# Altium schematic sheet H3_DDR3.SchDoc
size A3
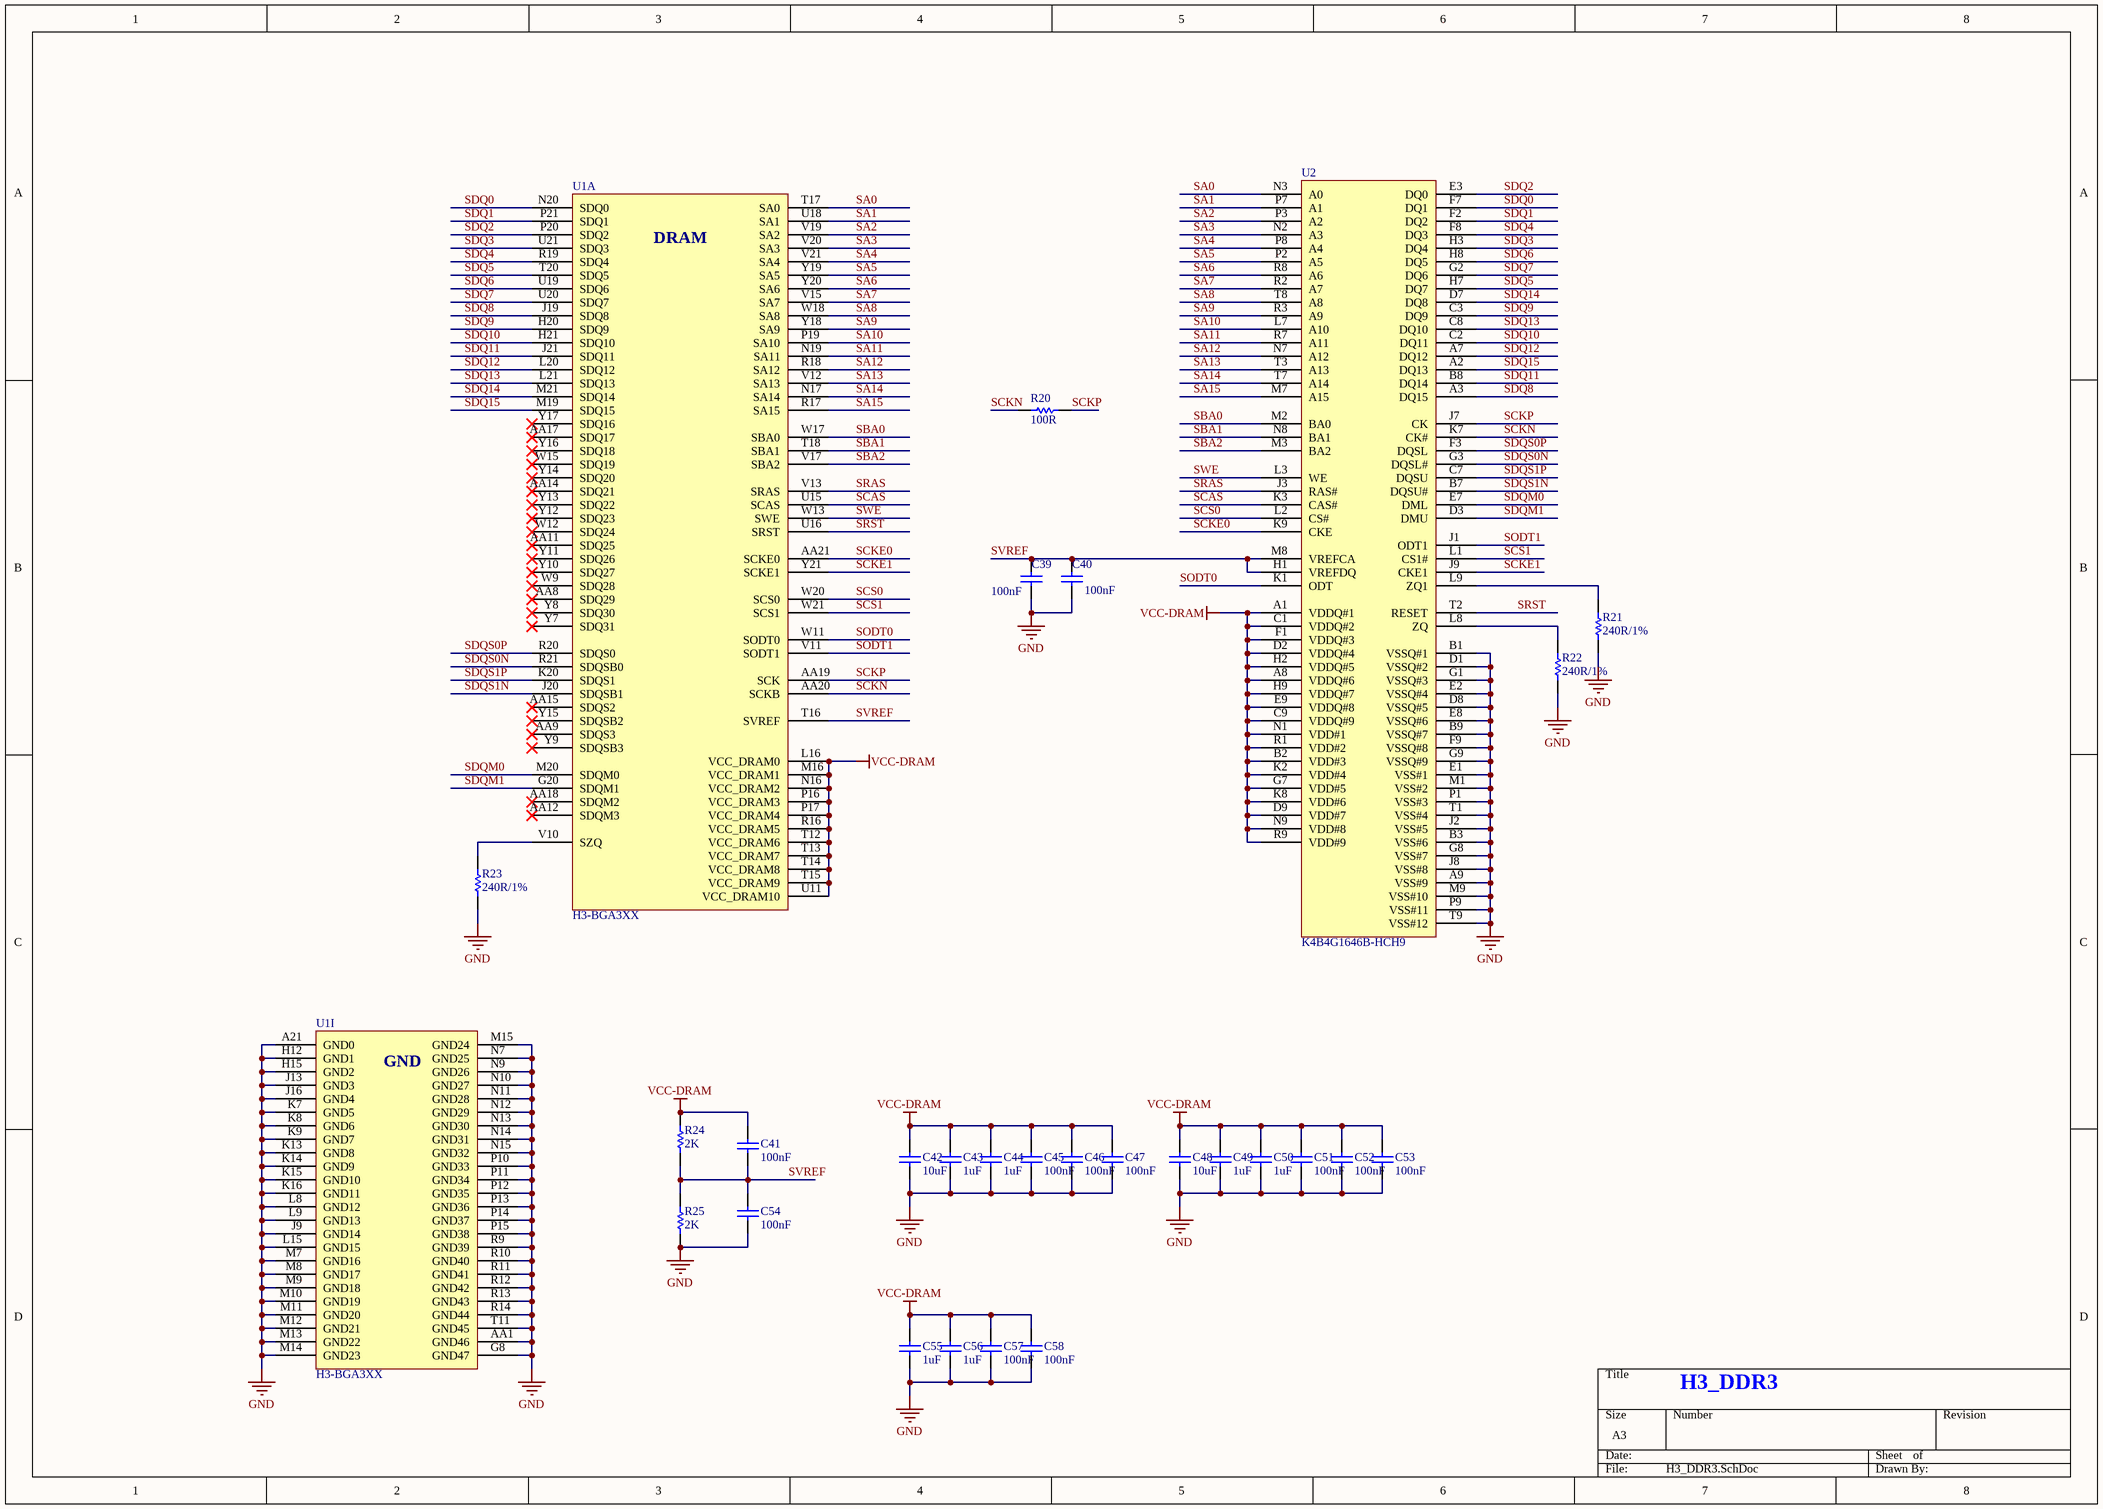
[diagram p0: H3_DDR3.SchDoc]

## Parts
C39  100nF  [C0402]
C40  100nF  [C0402]
C41  100nF  [C0402]
C42  10uF  [C0603]
C43  1uF  [C0402]
C44  1uF  [C0402]
C45  100nF  [C0402]
C46  100nF  [C0402]
C47  100nF  [C0402]
C48  10uF  [C0603]
C49  1uF  [C0402]
C50  1uF  [C0402]
C51  100nF  [C0402]
C52  100nF  [C0402]
C53  100nF  [C0402]
C54  100nF  [C0402]
C55  1uF  [C0402]
C56  1uF  [C0402]
C57  100nF  [C0402]
C58  100nF  [C0402]
R20  100R  [R0402]
R21  240R/1%  [R0402]
R22  240R/1%  [R0402]
R23  240R/1%  [R0402]
R24  2K  [R0402]
R25  2K  [R0402]
U1  H3-BGA3XX  [BGA-H3-347]  (parts A,I of 9)
U2  K4B4G1646B-HCH9  [FBGA-96]

## Nets
GND: C39.1 C40.1 C42.1 C43.1 C44.1 C45.1 C46.1 C47.1 C48.1 C49.1 C50.1 C51.1 C52.1 C53.1 C54.1 C55.1 C56.1 C57.1 C58.1 R21.1 R22.1 R23.1 R25.2 U1.A21(GND0) U1.AA1(GND46) U1.G8(GND47) U1.H12(GND1) U1.H15(GND2) U1.J9(GND14) U1.J13(GND3) U1.J16(GND4) U1.K7(GND5) U1.K8(GND6) U1.K9(GND7) U1.K13(GND8) U1.K14(GND9) U1.K15(GND10) U1.K16(GND11) U1.L8(GND12) U1.L9(GND13) U1.L15(GND15) U1.M7(GND16) U1.M8(GND17) U1.M9(GND18) U1.M10(GND19) U1.M11(GND20) U1.M12(GND21) U1.M13(GND22) U1.M14(GND23) U1.M15(GND24) U1.N7(GND25) U1.N9(GND26) U1.N10(GND27) U1.N11(GND28) U1.N12(GND29) U1.N13(GND30) U1.N14(GND31) U1.N15(GND32) U1.P10(GND33) U1.P11(GND34) U1.P12(GND35) U1.P13(GND36) U1.P14(GND37) U1.P15(GND38) U1.R9(GND39) U1.R10(GND40) U1.R11(GND41) U1.R12(GND42) U1.R13(GND43) U1.R14(GND44) U1.T11(GND45) U2.A9(VSS#9) U2.B1(VSSQ#1) U2.B3(VSS#6) U2.B9(VSSQ#7) U2.D1(VSSQ#2) U2.D8(VSSQ#5) U2.E1(VSS#1) U2.E2(VSSQ#4) U2.E8(VSSQ#6) U2.F9(VSSQ#8) U2.G1(VSSQ#3) U2.G8(VSS#7) U2.G9(VSSQ#9) U2.J2(VSS#5) U2.J8(VSS#8) U2.M1(VSS#2) U2.M9(VSS#10) U2.P1(VSS#3) U2.P9(VSS#11) U2.T1(VSS#4) U2.T9(VSS#12)
VCC-DRAM: C41.2 C42.2 C43.2 C44.2 C45.2 C46.2 C47.2 C48.2 C49.2 C50.2 C51.2 C52.2 C53.2 C55.2 C56.2 C57.2 C58.2 R24.1 U1.L16(VCC_DRAM0) U1.M16(VCC_DRAM1) U1.N16(VCC_DRAM2) U1.P16(VCC_DRAM3) U1.P17(VCC_DRAM4) U1.R16(VCC_DRAM5) U1.T12(VCC_DRAM6) U1.T13(VCC_DRAM7) U1.T14(VCC_DRAM8) U1.T15(VCC_DRAM9) U1.U11(VCC_DRAM10) U2.A1(VDDQ#1) U2.A8(VDDQ#6) U2.B2(VDD#3) U2.C1(VDDQ#2) U2.C9(VDDQ#9) U2.D2(VDDQ#4) U2.D9(VDD#7) U2.E9(VDDQ#8) U2.F1(VDDQ#3) U2.G7(VDD#5) U2.H2(VDDQ#5) U2.H9(VDDQ#7) U2.K2(VDD#4) U2.K8(VDD#6) U2.N1(VDD#1) U2.N9(VDD#8) U2.R1(VDD#2) U2.R9(VDD#9)
SA0: U1.T17(SA0) U2.N3(A0)
SA1: U1.U18(SA1) U2.P7(A1)
SA2: U1.V19(SA2) U2.P3(A2)
SA3: U1.V20(SA3) U2.N2(A3)
SA4: U1.V21(SA4) U2.P8(A4)
SA5: U1.Y19(SA5) U2.P2(A5)
SA6: U1.Y20(SA6) U2.R8(A6)
SA7: U1.V15(SA7) U2.R2(A7)
SA8: U1.W18(SA8) U2.T8(A8)
SA9: U1.Y18(SA9) U2.R3(A9)
SA10: U1.P19(SA10) U2.L7(A10)
SA11: U1.N19(SA11) U2.R7(A11)
SA12: U1.R18(SA12) U2.N7(A12)
SA13: U1.V12(SA13) U2.T3(A13)
SA14: U1.N17(SA14) U2.T7(A14)
SA15: U1.R17(SA15) U2.M7(A15)
SBA0: U1.W17(SBA0) U2.M2(BA0)
SBA1: U1.T18(SBA1) U2.N8(BA1)
SBA2: U1.V17(SBA2) U2.M3(BA2)
SCAS: U1.U15(SCAS) U2.K3(CAS#)
SCKE0: U1.AA21(SCKE0) U2.K9(CKE)
SCKE1: U1.Y21(SCKE1) U2.J9(CKE1)
SCKN: R20.2 U1.AA20(SCKB) U2.K7(CK#)
SCKP: R20.1 U1.AA19(SCK) U2.J7(CK)
SCS0: U1.W20(SCS0) U2.L2(CS#)
SCS1: U1.W21(SCS1) U2.L1(CS1#)
SDQ0: U1.N20(SDQ0) U2.F7(DQ1)
SDQ1: U1.P21(SDQ1) U2.F2(DQ2)
SDQ2: U1.P20(SDQ2) U2.E3(DQ0)
SDQ3: U1.U21(SDQ3) U2.H3(DQ4)
SDQ4: U1.R19(SDQ4) U2.F8(DQ3)
SDQ5: U1.T20(SDQ5) U2.H7(DQ7)
SDQ6: U1.U19(SDQ6) U2.H8(DQ5)
SDQ7: U1.U20(SDQ7) U2.G2(DQ6)
SDQ8: U1.J19(SDQ8) U2.A3(DQ15)
SDQ9: U1.H20(SDQ9) U2.C3(DQ9)
SDQ10: U1.H21(SDQ10) U2.C2(DQ11)
SDQ11: U1.J21(SDQ11) U2.B8(DQ14)
SDQ12: U1.L20(SDQ12) U2.A7(DQ12)
SDQ13: U1.L21(SDQ13) U2.C8(DQ10)
SDQ14: U1.M21(SDQ14) U2.D7(DQ8)
SDQ15: U1.M19(SDQ15) U2.A2(DQ13)
SDQM0: U1.M20(SDQM0) U2.E7(DML)
SDQM1: U1.G20(SDQM1) U2.D3(DMU)
SDQS0N: U1.R21(SDQSB0) U2.G3(DQSL#)
SDQS0P: U1.R20(SDQS0) U2.F3(DQSL)
SDQS1N: U1.J20(SDQSB1) U2.B7(DQSU#)
SDQS1P: U1.K20(SDQS1) U2.C7(DQSU)
SODT0: U1.W11(SODT0) U2.K1(ODT)
SODT1: U1.V11(SODT1) U2.J1(ODT1)
SRAS: U1.V13(SRAS) U2.J3(RAS#)
SRST: U1.U16(SRST) U2.T2(RESET)
SVREF: C39.2 C40.2 C41.1 C54.2 R24.2 R25.1 U1.T16(SVREF) U2.H1(VREFDQ) U2.M8(VREFCA)
SWE: U1.W13(SWE) U2.L3(WE)
NetR21_2: R21.2 U2.L9(ZQ1)
NetR22_2: R22.2 U2.L8(ZQ)
NetR23_2: R23.2 U1.V10(SZQ)

Not connected (* = marked no-connect by the designer): U1 AA8(SDQ29)* AA9(SDQS3)* AA11(SDQ25)* AA12(SDQM3)* AA14(SDQ21)* AA15(SDQS2)* AA17(SDQ17)* AA18(SDQM2)* W9(SDQ28)* W12(SDQ24)* W15(SDQ19)* Y7(SDQ31)* Y8(SDQ30)* Y9(SDQSB3)* Y10(SDQ27)* Y11(SDQ26)* Y12(SDQ23)* Y13(SDQ22)* Y14(SDQ20)* Y15(SDQSB2)* Y16(SDQ18)* Y17(SDQ16)*

## Notes on the sheet
- H3_DDR3
- (in symbol H3-BGA3XX, part A) DRAM
- (in symbol H3-BGA3XX, part I) GND

## Library data of the parts
C39-C41 C43-C47 C49-C58 = C0402: 电容; Published: 8-Jun-2000; LatestRevisionDate: 17-Jul-2002; LatestRevisionNote: Re-released for DXP Platform.; PackageReference: RAD-0.3; Publisher: Altium Limited; PackageDescription: Radial Cap, Thru-Hole; 2 Leads; 0.3 in Pin Spacing; UnitPrice: 0.02
C42 C48 = C0603: 电容; Published: 8-Jun-2000; LatestRevisionDate: 17-Jul-2002; LatestRevisionNote: Re-released for DXP Platform.; PackageReference: RAD-0.3; Publisher: Altium Limited; PackageDescription: Radial Cap, Thru-Hole; 2 Leads; 0.3 in Pin Spacing; UnitPrice: 0.02
R20-R25 = RES0402: 电阻; Published: 8-Jun-2000; LatestRevisionDate: 17-Jul-2002; LatestRevisionNote: Re-released for DXP Platform.; PackageReference: AXIAL-0.3; Publisher: Altium Limited; PackageDescription: Axial Device, Thru-Hole; 2 Leads; 0.3 in Pin Spacing